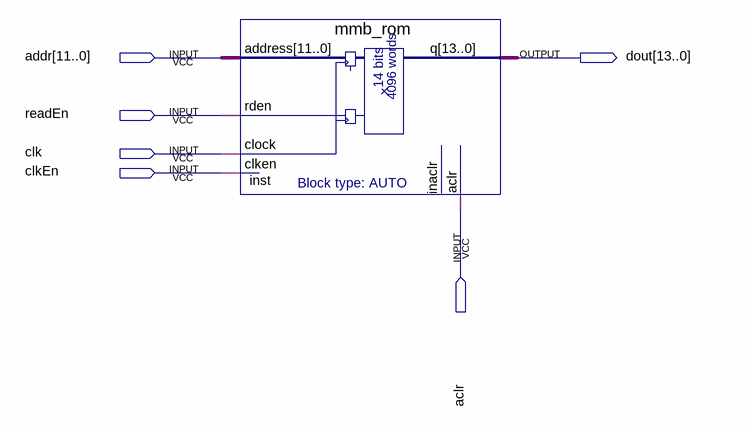
[diagram p0: schematic sheet]
// Quartus schematic mmb_DP_schematic.bdf as structural Verilog: 1 symbols, 6 pins
module mmb_DP_schematic (
  input  [11:0] addr,
  input  readEn,
  input  clk,
  input  clkEn,
  input  aclr,
  output [13:0] dout
);

  mmb_rom inst (.address(addr), .rden(readEn), .clock(clk), .clken(clkEn), .aclr(aclr), .q(dout));  // open: inaclr
endmodule
